# EAGLE schematic ledboard (EAGLE 6.6.0)
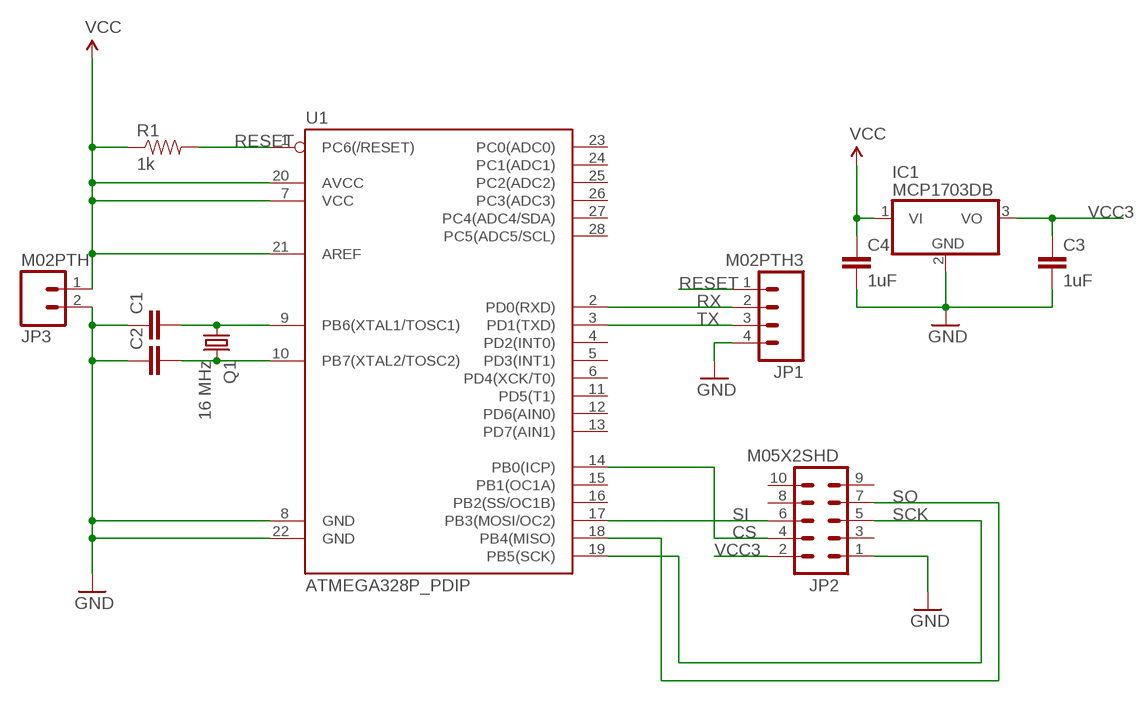
[diagram p0: schematic, sheet 1]

## Parts
C1  CAP0805  [0805]
C2  CAP0805  [0805]
C3  1uF  CAP0805  [0805]
C4  1uF  CAP0805  [0805]
IC1  MCP1703DB  [SOT223]
JP1  M02PTH3  M041X04_NO_SILK  [1X04_NO_SILK]
JP2  M05X2SHD  [2X5-SHROUDED]
JP3  M02PTH  [1X02]
Q1  16 MHz  CRYSTALSMD  [HC49UP]
R1  1k  RESISTOR0805-RES  [0805]
U1  ATMEGA328P_PDIP  [DIL28-3]

## Nets
CS: JP2.4 U1.14(PB0(ICP))
GND: C1.1 C2.1 C3.2 C4.2 IC1.2(GND) JP1.4 JP2.1 JP3.2 U1.8(GND) U1.22(GND)
N$1: C1.2 Q1.1 U1.9(PB6(XTAL1/TOSC1))
N$2: C2.2 Q1.2 U1.10(PB7(XTAL2/TOSC2))
RESET: JP1.1 R1.2 U1.1(PC6(/RESET))
RX: JP1.2 U1.2(PD0(RXD))
SCK: JP2.5 U1.19(PB5(SCK))
SI: JP2.6 U1.17(PB3(MOSI/OC2))
SO: JP2.7 U1.18(PB4(MISO))
TX: JP1.3 U1.3(PD1(TXD))
VCC: C4.1 IC1.1(VI) JP3.1 R1.1 U1.7(VCC) U1.20(AVCC) U1.21(AREF)
VCC3: C3.1 IC1.3(VO) JP2.2
Unconnected: JP2.3 JP2.8 JP2.9 JP2.10 U1.4(PD2(INT0)) U1.5(PD3(INT1)) U1.6(PD4(XCK/T0)) U1.11(PD5(T1)) U1.12(PD6(AIN0)) U1.13(PD7(AIN1)) U1.15(PB1(OC1A)) U1.16(PB2(SS/OC1B)) U1.23(PC0(ADC0)) U1.24(PC1(ADC1)) U1.25(PC2(ADC2)) U1.26(PC3(ADC3)) U1.27(PC4(ADC4/SDA)) U1.28(PC5(ADC5/SCL))

## Library data of the parts
C1-C4 = SparkFun-Passives:CAP: Capacitor Standard 0603 ceramic capacitor, and 0.1" leaded capacitor.
IC1 = linear:MCP1703: 250 mA, 16V, Low Quiescent Current LDO Regulator Source: http://ww1.microchip.com/downloads/en/DeviceDoc/22049b.pdf
JP1 = SparkFun-Connectors:M04: Header 4 Standard 4-pin 0.1" header. Use with straight break away headers (SKU : PRT-00116), right angle break away headers (PRT-00553), swiss pins (PRT-00743), machine pins (PRT-00117), and female headers (PRT-00115). Molex polarized connector foot print use with SKU : PRT-08231 with associated crimp pins and housings. 1MM SMD Version SKU: PRT-10208
JP2 = SparkFun-Connectors:M05X2: Header 5x2 Standard 10-pin dual row 0.1" header. Commonly used with AVR-ISP. Use with Spark Fun Electronics SKU: PRT-00778
JP3 = SparkFun-Connectors:M02: Standard 2-pin 0.1" header. Use with - straight break away headers ( PRT-00116) - right angle break away headers (PRT-00553) - swiss pins (PRT-00743) - machine pins (PRT-00117) - female headers (PRT-00115) Molex polarized connector foot print use with: PRT-08233 with associated crimp pins and housings. 2.54_SCREWTERM for use with PRT-10571. 3.5mm Screw Terminal footprints for PRT-08084 5mm Screw Terminal footprints for use with PRT-08433
Q1 = SparkFun-FreqCtrl:CRYSTAL: Various standard crystals. Proven footprints. Spark Fun Electronics SKU : COM-00534
R1 = SparkFun-Passives:RESISTOR: Resistor Basic schematic elements and footprints for 0603, 1206, and PTH resistors.
U1 = SparkFun-DigitalIC:ATMEGA328P_PDIP: uC used in the Arduino 32kb flash, 1k EEPROM, 2k SRAM This is the through-hole version of this chip.